# Altium schematic sheet SND2LIGHT.SchDoc
size A4; Organization: Altium Limited; Address1: 3 Minna Close; Address2: Belrose; Address3: NSW 2086; Address4: Australia
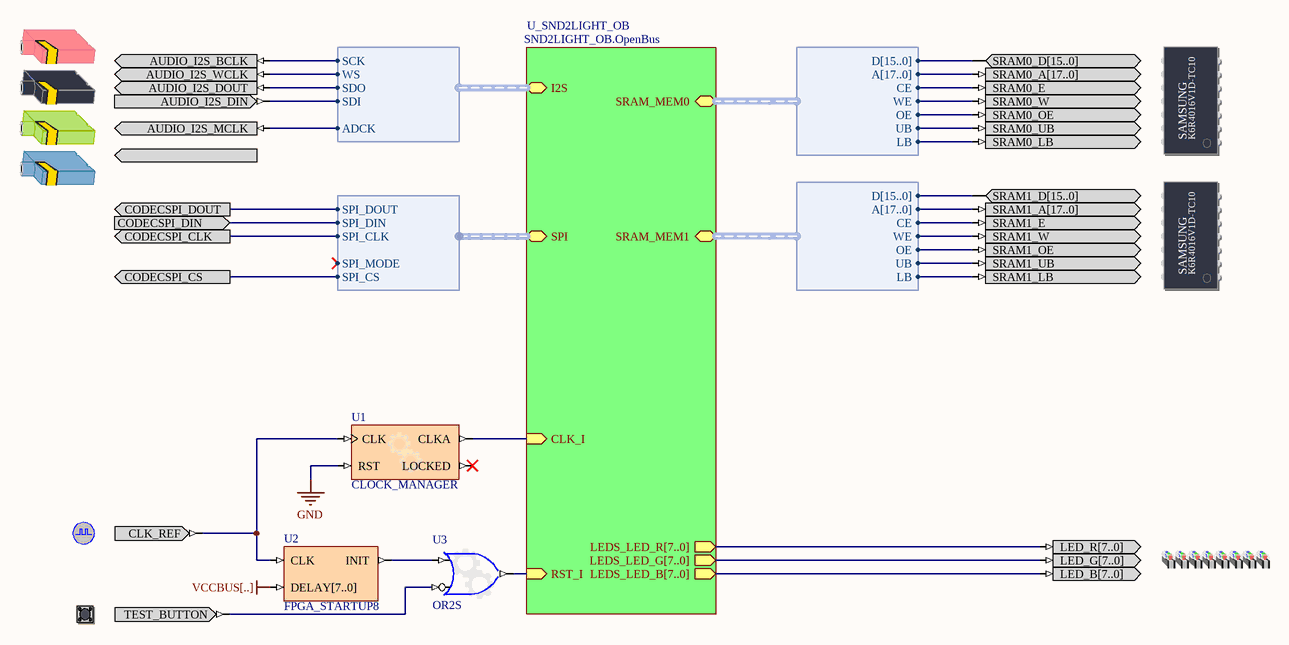
[diagram p0: SND2LIGHT.SchDoc]

## Parts
(Parts that share a designator on the sheet are numbered #1, #2 ... from top to bottom, then left to right.)
?#1  AUDIO_CODEC  (value not drawn)
?#2  SRAM_DAUGHTER0  (value not drawn)
?#3  SRAM_DAUGHTER1  (value not drawn)
?#4  CLOCK_REFERENCE  (value not drawn)
?#5  LEDS_RGB  (value not drawn)
?#6  TEST_BUTTON  (value not drawn)
U1  CLOCK_MANAGER
U2  FPGA_STARTUP8
U3  OR2S

## Sub-sheets
U_SND2LIGHT_OB = SND2LIGHT_OB.OpenBus: RST_I (in), CLK_I (in), SPI (harness SPI_W_NB), I2S (harness I2S_W_Both), SRAM_MEM0 (harness WB_MEM_CTRL_SRAM16_A18), SRAM_MEM1 (harness WB_MEM_CTRL_SRAM16_A18), LEDS_LED_R[7..0] (out), LEDS_LED_G[7..0] (out), LEDS_LED_B[7..0] (out)

## Ports
CODECSPI_CLK (out, see A14), CODECSPI_CS (out, see R6), CODECSPI_DIN (in, see AE2), CODECSPI_DOUT (out, see T4)

## Harnesses
WB_MEM_CTRL_SRAM16_A18: D[15..0], A[17..0], CE, WE, OE, UB, LB
I2S_W_Both: SCK, WS, SDO, SDI, ADCK
SPI_W_NB: SPI_DOUT, SPI_DIN, SPI_CLK, SPI_MODE, SPI_CS

## Nets
GND: U1.RST
VCCBUS[..]: U2.DELAY[7..0]
CODECSPI_CLK: port CODECSPI_CLK, sheet U_SND2LIGHT_OB/SPI.SPI_CLK
CODECSPI_CS: port CODECSPI_CS, sheet U_SND2LIGHT_OB/SPI.SPI_CS
CODECSPI_DIN: port CODECSPI_DIN, sheet U_SND2LIGHT_OB/SPI.SPI_DIN
CODECSPI_DOUT: port CODECSPI_DOUT, sheet U_SND2LIGHT_OB/SPI.SPI_DOUT
Net?#1_AUDIO_I2S_BCLK: ?#1.AUDIO_I2S_BCLK ; sheet U_SND2LIGHT_OB/I2S.SCK
Net?#1_AUDIO_I2S_DIN: ?#1.AUDIO_I2S_DIN ; sheet U_SND2LIGHT_OB/I2S.SDI
Net?#1_AUDIO_I2S_DOUT: ?#1.AUDIO_I2S_DOUT ; sheet U_SND2LIGHT_OB/I2S.SDO
Net?#1_AUDIO_I2S_MCLK: ?#1.AUDIO_I2S_MCLK ; sheet U_SND2LIGHT_OB/I2S.ADCK
Net?#1_AUDIO_I2S_WCLK: ?#1.AUDIO_I2S_WCLK ; sheet U_SND2LIGHT_OB/I2S.WS
Net?#2_SRAM0_A[17..0]: ?#2.SRAM0_A[17..0] ; sheet U_SND2LIGHT_OB/SRAM_MEM0.A[17..0]
Net?#2_SRAM0_D[15..0]: ?#2.SRAM0_D[15..0] ; sheet U_SND2LIGHT_OB/SRAM_MEM0.D[15..0]
Net?#2_SRAM0_E: ?#2.SRAM0_E ; sheet U_SND2LIGHT_OB/SRAM_MEM0.CE
Net?#2_SRAM0_LB: ?#2.SRAM0_LB ; sheet U_SND2LIGHT_OB/SRAM_MEM0.LB
Net?#2_SRAM0_OE: ?#2.SRAM0_OE ; sheet U_SND2LIGHT_OB/SRAM_MEM0.OE
Net?#2_SRAM0_UB: ?#2.SRAM0_UB ; sheet U_SND2LIGHT_OB/SRAM_MEM0.UB
Net?#2_SRAM0_W: ?#2.SRAM0_W ; sheet U_SND2LIGHT_OB/SRAM_MEM0.WE
Net?#3_SRAM1_A[17..0]: ?#3.SRAM1_A[17..0] ; sheet U_SND2LIGHT_OB/SRAM_MEM1.A[17..0]
Net?#3_SRAM1_D[15..0]: ?#3.SRAM1_D[15..0] ; sheet U_SND2LIGHT_OB/SRAM_MEM1.D[15..0]
Net?#3_SRAM1_E: ?#3.SRAM1_E ; sheet U_SND2LIGHT_OB/SRAM_MEM1.CE
Net?#3_SRAM1_LB: ?#3.SRAM1_LB ; sheet U_SND2LIGHT_OB/SRAM_MEM1.LB
Net?#3_SRAM1_OE: ?#3.SRAM1_OE ; sheet U_SND2LIGHT_OB/SRAM_MEM1.OE
Net?#3_SRAM1_UB: ?#3.SRAM1_UB ; sheet U_SND2LIGHT_OB/SRAM_MEM1.UB
Net?#3_SRAM1_W: ?#3.SRAM1_W ; sheet U_SND2LIGHT_OB/SRAM_MEM1.WE
Net?#4_CLK_REF: ?#4.CLK_REF U1.CLK U2.CLK
Net?#5_LED_B[7..0]: ?#5.LED_B[7..0] ; sheet U_SND2LIGHT_OB/LEDS_LED_B[7..0]
Net?#5_LED_G[7..0]: ?#5.LED_G[7..0] ; sheet U_SND2LIGHT_OB/LEDS_LED_G[7..0]
Net?#5_LED_R[7..0]: ?#5.LED_R[7..0] ; sheet U_SND2LIGHT_OB/LEDS_LED_R[7..0]
Net?#6_TEST_BUTTON: ?#6.TEST_BUTTON U3.I1
NetU1_CLKA: U1.CLKA ; sheet U_SND2LIGHT_OB/CLK_I
NetU2_INIT: U2.INIT U3.I0
NetU3_O: U3.O ; sheet U_SND2LIGHT_OB/RST_I

Not connected (* = marked no-connect by the designer): U1 LOCKED*

## Notes on the sheet
- Title
- Size:
- Date:
- A4
- Number:
- Time:
- Revision:
- Sheet
- of
- File:
- (in symbol SRAM_DAUGHTER0) SAMSUNG; K6R4016V1D-TC10
- (in symbol SRAM_DAUGHTER1) SAMSUNG; K6R4016V1D-TC10

## Library data of the parts
?#1 = AUDIO_CODEC: Audio Codec; PortComponent: True; IncludeInDSF: AUDIO_CS4270; Published: 22-Jan-2007; Publisher: Altium Limited; HelpURL: TR0145 Technical Reference for Altium's Audio-Video Peripheral Board PB01.pdf#page=12
?#2 = SRAM_DAUGHTER0: Free Static RAM - Daughterboard; PortComponent: True; Published: 14-May-2007; Publisher: Altium Limited; HelpURL: TR0143 NanoBoard Technical Reference Manual - NB2.pdf#page=24
?#3 = SRAM_DAUGHTER1: Free Static RAM - Daughterboard; PortComponent: True; Published: 14-May-2007; Publisher: Altium Limited; HelpURL: TR0143 NanoBoard Technical Reference Manual - NB2.pdf#page=24
?#4 = CLOCK_REFERENCE: Global System Clock Reference Supply; PortComponent: True; Published: 19-Nov-2003; Publisher: Altium Limited; HelpURL: TR0143 Technical Reference Manual for Altium's Desktop NanoBoard NB2DSK01.pdf#page=41
?#5 = LEDS_RGB: LEDS RGB; PortComponent: True; Published: 11-Mar-2009; Publisher: Altium Limited
?#6 = TEST_BUTTON: Test / Reset Button; PortComponent: True; Published: 19-Nov-2003; Publisher: Altium Limited; HelpURL: TR0143 Technical Reference Manual for Altium's Desktop NanoBoard NB2DSK01.pdf#page=53
U1 = CLOCKMANAGER: Configurable Clock Manager; ConfiguratorName: GENERIC_CLOCKMANAGER; ConfigurationParameters: {}Version[1.0]{}Option_Configuration[object TClockManagerPersist / VersionMajor [ 0 / VersionMinor [ 0 / InputFreq [ 20.000000000000000000 / InputName [ 'CLK' / OutputTargets [ < / item / Name [ 'CLKA' / OutFreqMin [ 50.000000000000000000 / OutFreqMax [ 50.000000000000000000 / OutPostDivider [ 1.000000000000000000 / end> / OutputDevices [ < / item / Name [ 'Spartan3AN' / Valid [ True / OutputActuals [ < / item / Name [ 'CLK0' / Multipler [ 1.000000000000000000 / Divider [ 1.000000000000000000 / OutFreq [ 20.000000000000000000 / OutputMap [ 1 / end / item / Name [ 'CLK90' / Multipler [ 1.000000000000000000 / Divider [ 1.000000000000000000 / OutPhase [ 90.000000000000000000 / OutFreq [ 20.000000000000000000 / OutputMap [ 2 / end / item / Name [ 'CLK180' / Multipler [ 1.000000000000000000 / Divider [ 1.000000000000000000 / OutPhase [ 180.000000000000000000 / OutFreq [ 20.000000000000000000 / OutputMap [ 3 / end / item / Name [ 'CLK270' / Multipler [ 1.000000000000000000 / Divider [ 1.000000000000000000 / OutPhase [ 270.000000000000000000 / OutFreq [ 20.000000000000000000 / OutputMap [ 4 / end / item / Name [ 'CLK2X' / Multipler [ 2.000000000000000000 / Divider [ 1.000000000000000000 / OutFreq [ 40.000000000000000000 / OutputMap [ 5 / end / item / Name [ 'CLKDV' / Multipler [ 1.000000000000000000 / Divider [ 16.000000000000000000 / OutFreq [ 1.250000000000000000 / OutputMap [ 6 / end / item / Name [ 'CLK2X180' / Multipler [ 1.000000000000000000 / Divider [ 1.000000000000000000 / OutPhase [ 180.000000000000000000 / OutFreq [ 40.000000000000000000 / OutputMap [ 7 / end / item / Name [ 'CLKFX' / Multipler [ 5.000000000000000000 / Divider [ 2.000000000000000000 / OutFreq [ 50.000000000000000000 / OutputMap [ 0 / end / item / Name [ 'CLKFX180' / Multipler [ 1.000000000000000000 / Divider [ 1.000000000000000000 / OutPhase [ 180.000000000000000000 / OutFreq [ 50.000000000000000000 / OutputMap [ 8 / end> / InternalActuals [ <> / CustomVars [ <> / end> / MinInputFreq [ 1.000000000000000000 / MaxInputFreq [ 280.000000000000000000 / MinOutputFreq [ 18.000000000000000000 / MaxOutputFreq [ 210.000000000000000000 / MaxOutputCount [ 9 / end]{}; LastRevisionNo: 1.00.00; Published: 18-Feb-2009; Publisher: Altium Limited; HelpURL: https://wiki.altium.com/display/ADOH/New+Configurable+Generic+FPGA+Logic+Components
U2 = FPGA_STARTUP8: FPGA Startup With 8 Bit Delay; Published: 9-Dec-2004; Publisher: Altium Limited; HelpURL: CR0119 FPGA_STARTUPx Powerup Delay Unit.pdf; LastRevisionNo: 1.00.00; ComponentLink1Description: Core &Resource Usage; ComponentLink1URL: CR0139 FPGA Peripheral Resource Usage.pdf#page=11
U3 = GATE: Configurable Generic Gate; ConfiguratorName: GENERIC_GATE; ConfigurationParameters: {}Version[1.0]{}GateKind[OR]{}BusInput[False]{}GateInputType[Bit]{}GateOutputOption[Normal]{}BusWidth[8]{}RegisterOutputs[False]{}NegativeClockEdge[False]{}InputCount[2]{}InputInvert0[False]{}InputInvert1[True]{}; LastRevisionNo: 1.00.00; Published: 3-Sep-2008; Publisher: Altium Limited